# EAGLE design helium (EAGLE 7.7.0)
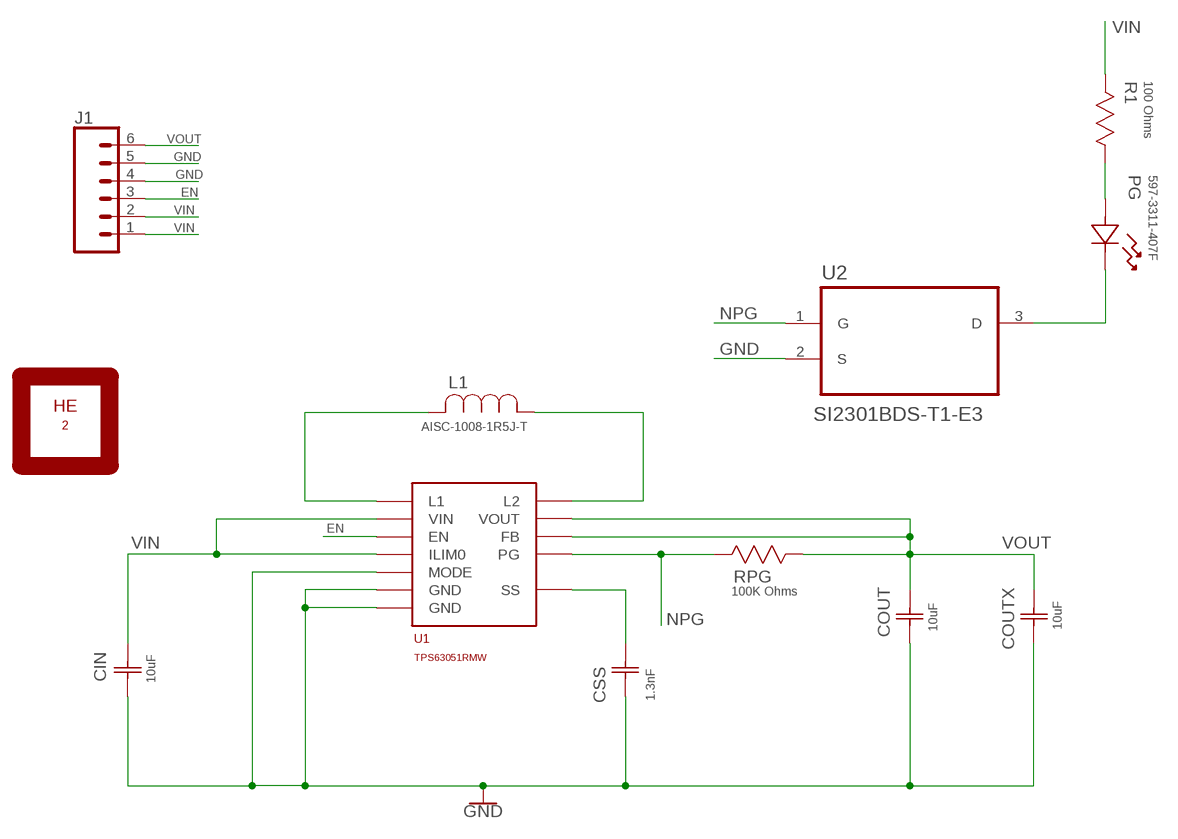
[diagram p0: schematic, sheet 1]

## Parts
CIN  10uF  GRM188R60J106ME47D  [CAPC1608X85N]
COUT  10uF  GRM188R60J106ME47D  [CAPC1608X85N]
COUTX  10uF  GRM188R60J106ME47D  [CAPC1608X85N]
CSS  1.3nF  C0402C132J5GACTU  [CAPC1005X60N]
HE  2  PERIODIC_SYMBOL  [PERIODIC_SYMBOL_BACK]
J1  CONN_06LONGPADS  [1X06_LONGPADS]
L1  AISC-1008-1R5J-T  [AISC-1008]
PG  597-3311-407F  [LED_597-3311-407F]
R1  100 Ohms  9C04021A1000FLHF3  [RESC1005X40N]
RPG  100K Ohms  CRCW0603100KFKEA  [RESC1608X60N]
U1  TPS63051RMW  TPS6305X  [RMW12]
U2  SI2301BDS-T1-E3  [SOT95P237X112-3N]

## Nets
EN: J1.3 U1.P$11(EN)
GND: CIN.1(C1) COUT.1(C1) COUTX.1(C1) CSS.1(C1) J1.4 J1.5 U1.P$2(GND) U1.P$6(MODE) U1.P$9(GND) U2.2(S)
L1: L1.2 U1.P$1(L1)
L2: L1.1 U1.P$3(L2)
N$3: PG.1 U2.3(D)
N$4: PG.2 R1.1(R1)
NPG: RPG.2 U1.P$8(PG) U2.1(G)
SS: CSS.2(C2) U1.P$7(SS)
VIN: CIN.2(C2) J1.1(>NAME) J1.2 R1.2(R2) U1.P$10(ILIM0) U1.P$12(VIN)
VOUT: COUT.2(C2) COUTX.2(C2) J1.6 RPG.1 U1.P$4(VOUT) U1.P$5(FB)

## Library data of the parts
CIN COUT COUTX = Murata_By_element14_Batch_1:GRM188R60J106ME47D: CAPACITOR, 0603; MPN: GRM188R60J106ME47D; OC_FARNELL: 1735528; OC_NEWARK: 24R6334; SUPPLIER: Murata; TOLERANCE: ±20%; VOLTAGERATING: 6.3V
CSS = Kemet_By_element14_Batch_1:C0402C132J5GACTU: CAPACITOR, 0402; MPN: C0402C132J5GACTU; OC_FARNELL: 1865439; OC_NEWARK: 29T8930; SUPPLIER: KEMET; TOLERANCE: ±5%; VOLTAGERATING: 50V
HE = 32bits:PERIODIC_SYMBOL; DESC: rev.0
J1 = SparkFun-Connectors:CONN_06: Multi connection point. Often used as Generic Header-pin footprint for 0.1 inch spaced/style header connections On any of the 0.1 inch spaced packages, you can populate with these: Break Away Headers - Straight <https://www.sparkfun.com/products/116> (PRT-00116) Break Away Male Headers - Right Angle <https://www.sparkfun.com/products/553> (PRT-00553) Female Headers <https://www.sparkfun.com/products/115> (PRT-00115) Break Away Headers - Machine Pin <https://www.sparkfun.com/products/117> (PRT-00117) Break Away Female Headers - Swiss Machine Pin <https://www.sparkfun.com/products/743> (PRT-00743) Arduino Stackable Header - 6 Pin <https://www.sparkfun.com/products/9280> (PRT-09280) For SCREWTERMINALS and SPRING TERMINALS visit here: Screw Terimnals on SparkFun.com <https://www.sparkfun.com/search/results?term=Screw+Terminals> (5mm/3.5mm/2.54mm spacing) This device is also useful as a general connection point to wire up your design to another part of your project. Our various solder wires solder well into these plated through hole pads. Hook-Up Wire - Assortment (Stranded, 22 AWG) <https://www.sparkfun.com/products/11375> (PRT-11375) Hook-Up Wire - Assortment (Solid Core, 22 AWG) <https://www.sparkfun.com/products/11367> (PRT-11367) View the entire wire category on our website here <https://www.sparkfun.com/categories/141>
L1 = 32bits:AISC-1008-1R5J-T; MANUFACTURER_PART_NUMBER: AISC10081R5JT; VENDOR: Abracon
PG = Dialight_By_element14_Batch_1:597-3311-407F: LED 1206 Green SMT; COLOR: Green; MPN: 597-3311-407F; OC_FARNELL: 1519493; OC_NEWARK: 30K4957; PACKAGE: 1206- Green LED; SUPPLIER: Dialight
R1 = Yageo_By_element14_Batch_1:9C04021A1000FLHF3: RESISTOR, 0402; MPN: 9C04021A1000FLHF3; OC_FARNELL: -; OC_NEWARK: 68H9765; SUPPLIER: YAGEO; TOLERANCE: ±1%; WATTAGE: 0.0625 W
RPG = Vishay_By_element14_Batch_1:CRCW0603100KFKEA: RESISTOR, 0603; MPN: CRCW0603100KFKEA; OC_FARNELL: 1469649; OC_NEWARK: 42K3668; SUPPLIER: Vishay; TOLERANCE: ± 1.0 %; WATTAGE: 0.1W
U1 = 32bits:TPS6305X
U2 = Vishay_By_element14_Batch_1:SI2301BDS-T1-E3: MOSFET; MPN: SI2301BDS-T1-E3; OC_FARNELL: 1470099; OC_NEWARK: 06J7561; PACKAGE: SOT-23-3; SUPPLIER: VISHAY

## Board
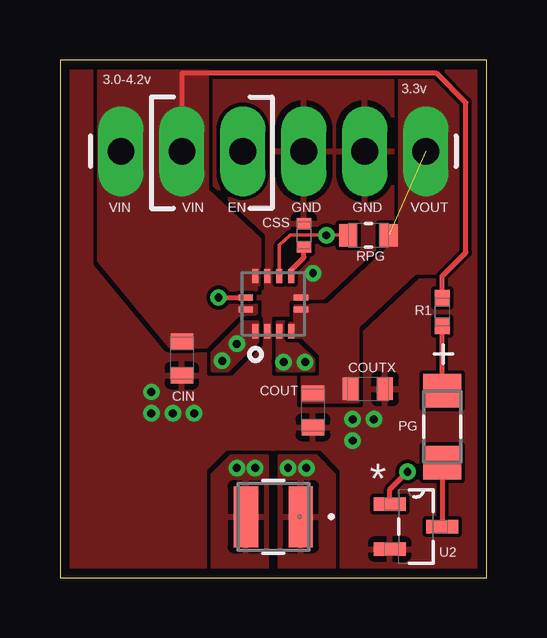
[diagram p1: board, top side]
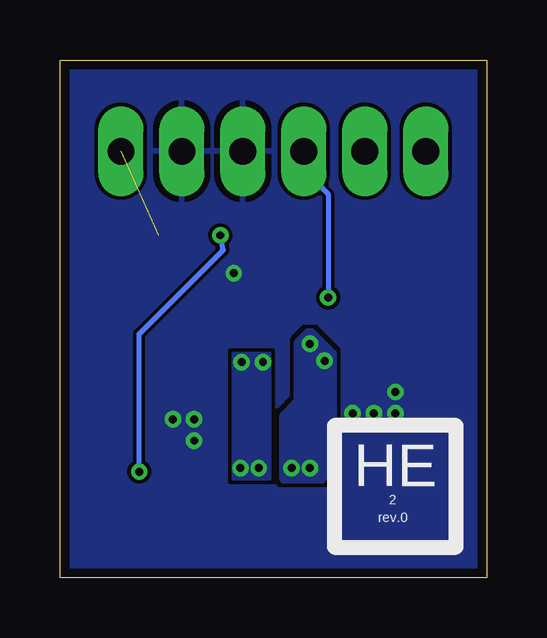
[diagram p2: board, bottom side, seen from below]

Size 17.78 x 21.59 mm. Coordinates in mm from the lower left corner, seen from the top.
Outline: 0,0 17.78,0 17.78,21.59 0,21.59 0,0
Copper layers (1*16): Top 0.0356mm / dielectric 1.5011mm / Bottom 0.0356mm
Design rules "oshpark-2layer *": minimum track width 6mil, minimum drill 13mil, track to track 6mil, track to pad 6mil, pad to pad 6mil, via to via 6mil, smd to smd 6mil, copper to edge 15mil, drill to drill 6mil, minimum pad ring 7mil, minimum via ring 7mil, stop-mask expansion 2.5mil, vias tented up to drill 0mil, thermal gap 10mil

### Footprints (pad centres in the part's own frame; a part is rotated, then mirrored left to right if it is on the bottom)
CAPC1608X85N = smd 0.66 x 0.94: 1 -0.711,0; 2 0.711,0
CAPC1005X60N = smd 0.457 x 0.61: 1 -0.483,0; 2 0.483,0
1X06_LONGPADS = drill 1.118 pad 1.88 long: 1 0,0; 2 2.54,0; 3 5.08,0; 4 7.62,0; 5 10.16,0; 6 12.7,0
AISC-1008 = smd 1.016 x 2.54: 1 -1.143,0; 2 1.143,0
LED_597-3311-407F = smd 1.397 x 1.6: 1 -1.499,0; 2 1.499,0
RESC1005X40N = smd 0.66 x 0.61: 1 -0.584,0; 2 0.584,0
RESC1608X60N = smd 0.762 x 0.94: 1 -0.838,0; 2 0.838,0
RMW12 = smd 0.6 x 0.25: P$1 -1.15,0.75; P$2 -1.15,0.25; P$3 -1.15,-0.25; P$4 -1.15,-0.75; P$7 1.15,-0.75; P$8 1.15,-0.25; P$9 1.15,0.25; P$10 1.15,0.75 | smd 0.25 x 0.6: P$5 -0.25,-1.15; P$6 0.25,-1.15; P$11 0.25,1.15; P$12 -0.25,1.15
SOT95P237X112-3N = smd 1.321 x 0.559: 1 -1.092,0.94; 2 -1.092,-0.94; 3 1.092,0

### Placement (x,y rotation side)
CIN  5.08,9.14 90 top
COUT  10.54,6.99 90 top
COUTX  12.83,7.87 180 top
CSS  10.16,14.27 270 top
HE  1.27,1.27 0 top
J1  2.54,17.78 0 top
L1  8.89,2.54 180 top
PG  15.93,6.3 90 top
R1  15.93,11.07 90 top
RPG  12.85,14.28 180 top
U1  8.89,11.43 90 top
U2  14.83,2.13 0 top

### Tracks (layer width: path | path; a pad name or v marks a point on that pad's centre or on a via)
EN  (via drill 0.33)
  Top 0.203: v6.6,11.68 U1.P$11
  Bottom 0.203: J1.3 7.62,17.02 6.6,16 v6.6,11.68
GND  (via drill 0.33)
  other vias: 5.59,6.86 4.7,6.86 3.81,6.86 3.81,7.75 12.19,5.71 12.19,6.6 13.08,6.6 10.54,12.7
  pour Top (rank 5): 0,21.59 17.78,21.59 17.78,0 0,0
  pour Bottom (rank 4): 0,21.59 17.78,21.59 17.78,0 0,0
L1  (via drill 0.33)
  other vias: 7.37,4.57 8.13,4.57 7.37,9.75 6.76,9.04
  pour Top (rank 2): 8.64,0 8.64,5.08 7.11,5.08 6.35,4.32 6.35,0
  pour Top: 8.23,10.67 8.23,9.86 7.01,8.64 6.35,8.64 6.35,9.4 7.62,10.67
  pour Bottom: 7.37,10.26 6.45,9.35 6.45,4.57 6.91,4.11 8.43,4.11 8.43,6.76 7.82,7.37 7.82,9.8
L2  (via drill 0.33)
  other vias: 10.26,4.57 9.5,4.57 10.21,8.99 9.32,8.99
  pour Top: 9.14,5.08 9.14,0 11.43,0 11.43,4.32 10.67,5.08
  pour Top (no thermals): 9.04,10.67 9.04,8.64 10.57,8.64 10.57,9.09 9.91,9.75 9.4,9.75 9.4,10.67
  pour Bottom: 9.04,9.35 9.04,4.11 10.57,4.11 10.57,9.35
N$3
  Top 0.203: PG.1 U2.3
N$4
  Top 0.203: PG.2 R1.1
NPG  (via drill 0.33)
  Top 0.152: U1.P$8 9.14,13.86 9.6,14.28 v11.1,14.28 RPG.2
  Top 0.203: U2.1 13.74,3.68 v14.48,4.42
  Bottom 0.203: v14.48,4.42 14.48,10.16 10.97,13.67 v11.1,14.28
SS
  Top 0.203: U1.P$7 9.64,12.84 9.75,12.95 10.16,13.36 CSS.2
VIN
  Top 0.203: R1.2 15.93,12.57 16.92,13.56 16.92,19.81 15.7,21.03 5.08,21.03 J1.2
  pour Top (rank 3, no thermals): 8.13,11.02 7.67,11.02 6.3,9.65 4.62,9.65 1.65,13.23 1.65,21.59 6.1,21.59 6.1,16.15 8.28,14.12 8.28,12.24 8.13,12.24
VOUT  (1 unrouted)
  pour Top (rank 3, no thermals): 9.8,11.33 9.8,10.57 9.5,10.57 9.5,9.96 9.96,9.96 10.72,9.19 10.72,8.43 10.11,8.43 10.11,7.37 12.4,7.37 12.4,10.49 14.78,12.75 17.07,12.75 17.12,21.49 14.17,21.49 14.17,14.15 11.18,11.33

### Text on the board
tPlace: 3.0-4.2v | 3.3v | VIN | VIN | EN | GND | GND | VOUT